# EAGLE schematic lv_power (EAGLE 6.6.0)
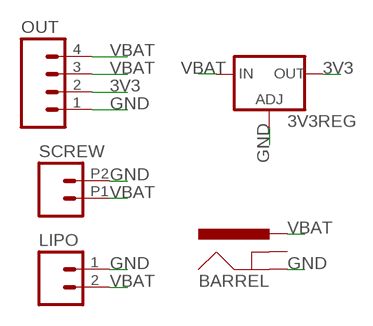
[diagram p0: schematic, sheet 1]

## Parts
3V3REG  V_REG_317DPACK  [V-REG_DPACK]
BARREL  POWER_JACKPTH_BREAD  [POWER_JACK_PTH_BREAD]
LIPO  M02-JST-2MM-SMT  [JST-2-SMD]
OUT  M04PTH  [1X04]
SCREW  M022.54MM_SCREWTERM  [1X02_2.54_SCREWTERM]

## Nets
3V3: 3V3REG.4(OUT) OUT.2
GND: 3V3REG.1(ADJ) BARREL.GND LIPO.1 OUT.1 SCREW.P2
VBAT: 3V3REG.3(IN) BARREL.PWR LIPO.2 OUT.3 OUT.4 SCREW.P1
Unconnected: BARREL.GNDBREAK

## Library data of the parts
3V3REG = SparkFun-PowerIC:V_REG_317: Voltage Regulator Standard LM317 adjustable voltage regulator. AOI (Adjust Output Input). Google 'LM317 Calculator' for easy to use app to get the two resistor values needed. 240/720 for 5V output. 240/390 for 3.3V output. Spark Fun Electronics SKU : COM-00527
BARREL = SparkFun-Connectors:POWER_JACK: Power Jack This is the standard 5.5mm barrel jack for power. The PTH is the most common, proven, reliable, footprint. The Slot footprint only works if the mill layer is transmitted to the PCB fab house so be warned. Mating wall wart : TOL-00298 (and others); PROD_ID: PRT-10811
LIPO = SparkFun-Connectors:M02: Standard 2-pin 0.1" header. Use with - straight break away headers ( PRT-00116) - right angle break away headers (PRT-00553) - swiss pins (PRT-00743) - machine pins (PRT-00117) - female headers (PRT-00115) Molex polarized connector foot print use with: PRT-08233 with associated crimp pins and housings. 2.54_SCREWTERM for use with PRT-10571. 3.5mm Screw Terminal footprints for PRT-08084 5mm Screw Terminal footprints for use with PRT-08433; PROD_ID: CONN-08352
OUT = SparkFun-Connectors:M04: Header 4 Standard 4-pin 0.1" header. Use with straight break away headers (SKU : PRT-00116), right angle break away headers (PRT-00553), swiss pins (PRT-00743), machine pins (PRT-00117), and female headers (PRT-00115). Molex polarized connector foot print use with SKU : PRT-08231 with associated crimp pins and housings. 1MM SMD Version SKU: PRT-10208
SCREW = SparkFun-Connectors:M02: Standard 2-pin 0.1" header. Use with - straight break away headers ( PRT-00116) - right angle break away headers (PRT-00553) - swiss pins (PRT-00743) - machine pins (PRT-00117) - female headers (PRT-00115) Molex polarized connector foot print use with: PRT-08233 with associated crimp pins and housings. 2.54_SCREWTERM for use with PRT-10571. 3.5mm Screw Terminal footprints for PRT-08084 5mm Screw Terminal footprints for use with PRT-08433